# Altium schematic sheet RS485.SchDoc
size A4
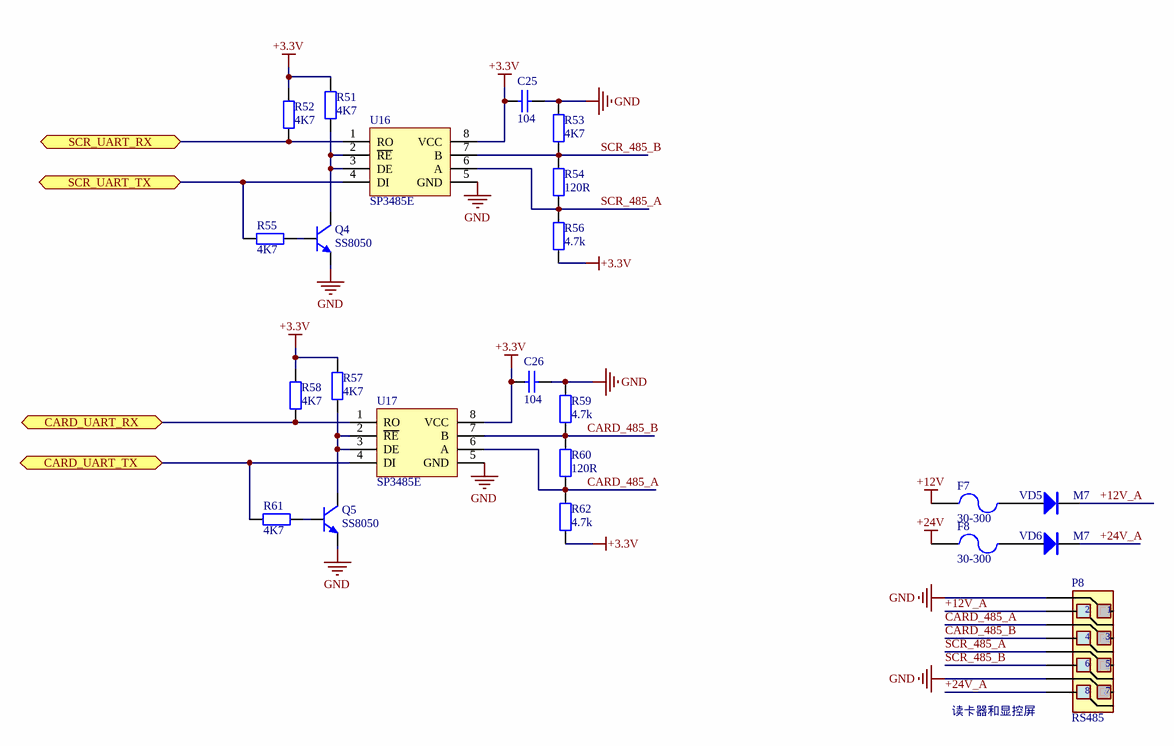
[diagram p0: RS485.SchDoc]

## Parts
C25  104  [C 0805]
C26  104  [C 0805]
F7  30-300  [FU 1812]
F8  30-300  [FU 1812]
P8  RS485  [557-2x4]
Q4  SS8050  [SOT23-3N]
Q5  SS8050  [SOT23-3N]
R51  4K7  [R 0805]
R52  4K7  [R 0805]
R53  4K7  [R 0805]
R54  120R  [R 0805]
R55  4K7  [R 0805]
R56  4.7k  [R 0805]
R57  4K7  [R 0805]
R58  4K7  [R 0805]
R59  4.7k  [R 0805]
R60  120R  [R 0805]
R61  4K7  [R 0805]
R62  4.7k  [R 0805]
U16  SP3485E  [SOP8_N]
U17  SP3485E  [SOP8_N]
VD5  M7  [SMA]
VD6  M7  [SMA]

## Ports
CARD_UART_RX (bidir), CARD_UART_TX (bidir), SCR_UART_RX (bidir), SCR_UART_TX (bidir)

## Nets
+3.3V: C25.2 C26.2 R51.2 R52.2 R56.1 R57.2 R58.2 R62.1 U16.8(VCC) U17.8(VCC)
+12V: F7.1
+24V: F8.1
GND: C25.1 C26.1 P8.1 P8.7 Q4.2(E) Q5.2(E) R53.2 R59.2 U16.5(GND) U17.5(GND)
+12V_A: P8.2 VD5.2(K)
+24V_A: P8.8 VD6.2(K)
CARD_485_A: P8.3 R60.1 R62.2 U17.6(A)
CARD_485_B: P8.4 R59.1 R60.2 U17.7(B)
CARD_UART_RX: R58.1 U17.1(RO) ; port CARD_UART_RX
CARD_UART_TX: R61.2 U17.4(DI) ; port CARD_UART_TX
SCR_485_A: P8.5 R54.1 R56.2 U16.6(A)
SCR_485_B: P8.6 R53.1 R54.2 U16.7(B)
SCR_UART_RX: R52.1 U16.1(RO) ; port SCR_UART_RX
SCR_UART_TX: R55.2 U16.4(DI) ; port SCR_UART_TX
NetF7_2: F7.2 VD5.1(A)
NetF8_2: F8.2 VD6.1(A)
NetQ4_1: Q4.1(B) R55.1
NetQ4_3: Q4.3(C) R51.1 U16.2(~{RE}) U16.3(DE)
NetQ5_1: Q5.1(B) R61.1
NetQ5_3: Q5.3(C) R57.1 U17.2(~{RE}) U17.3(DE)

## Notes on the sheet
- 读卡器和显控屏
- 设 计
- 制 图
- 审 核
- 类 别
- 签  字
- 日 期
- 产 品
- 名 称
- 零 件
- 板  名
- 数  量
- 共  张
- 第  张
- 批 准
- 文件编号
- 沈阳市创奇游乐设备有限公司

## Library data of the parts
C25 C26 = Cap1
F7 F8 = Fuse 2: Fuse; Published: 8-Jun-2000; LatestRevisionDate: 17-Jul-2002; LatestRevisionNote: Re-released for DXP Platform.; PackageReference: PIN-W2/E2.8; Publisher: Altium Limited
P8 = 557-2x4: 接插件
Q4 Q5 = 8050-SMD: 高频放大-NPN型; 版权归属: 源创客; 属性: 40V 1.5A 1W 100MHZ; BOM名称: 高频放大-NPN型; 学习资源: www.ooocke.com
R51-R62 = Res1
U16 U17 = SP3485
VD5 VD6 = M7: 整流二极管; 版权归属: 源创客; BOM名称: 整流二极管; 学习资源: www.ooocke.com